# Altium schematic sheet Access_System_F.SchDoc
size A4; SheetNumber: 1; SheetTotal: 1
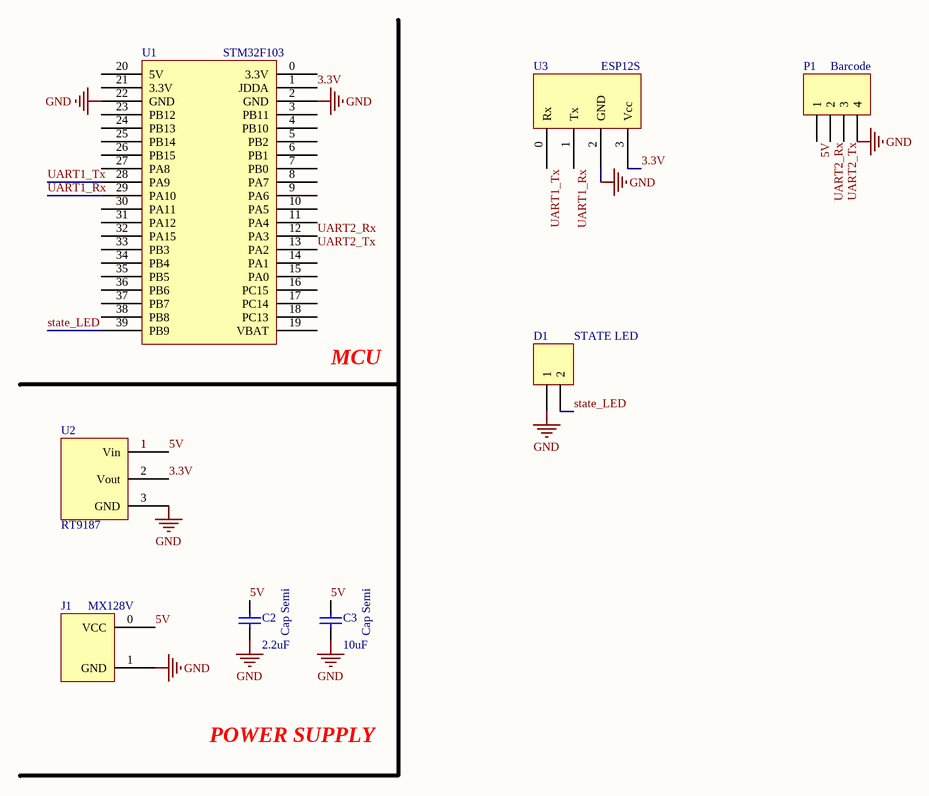
[diagram p0: Access_System_F.SchDoc]

## Parts
C2  Cap Semi  value 2.2uF  [1608[0603]]
C3  Cap Semi  value 10uF  [1608[0603]]
D1  STATE LED  [HDR1X2]
J1  MX128V  [MX128V]
P1  Barcode  [HDR1X4]
U1  STM32F103  [STM32F103]
U2  RT9187  [RT9187]
U3  ESP12S  [ESP12S]

## Nets
GND: C2.1 C3.1 D1.1 J1.1(GND) P1.4 U1.2(GND) U1.22(GND) U2.3(GND) U3.2(GND)
3.3V: U1.1(JDDA) U2.2(Vout) U3.3(Vcc)
5V: C2.2 C3.2 J1.0(VCC) P1.1 U2.1(Vin)
state_LED: D1.2 U1.39(PB9)
UART1_Rx: U1.29(PA10) U3.1(Tx)
UART1_Tx: U1.28(PA9) U3.0(Rx)
UART2_Rx: P1.2 U1.12(PA3)
UART2_Tx: P1.3 U1.13(PA2)

Not connected (* = marked no-connect by the designer): U1 0(3.3V) 3(PB11) 4(PB10) 5(PB2) 6(PB1) 7(PB0) 8(PA7) 9(PA6) 10(PA5) 11(PA4) 14(PA1) 15(PA0) 16(PC15) 17(PC14) 18(PC13) 19(VBAT) 20(5V) 21(3.3V) 23(PB12) 24(PB13) 25(PB14) 26(PB15) 27(PA8) 30(PA11) 31(PA12) 32(PA15) 33(PB3) 34(PB4) 35(PB5) 36(PB6) 37(PB7) 38(PB8)

## Notes on the sheet
- MCU
- POWER SUPPLY

## Library data of the parts
C2 C3 = Cap Semi: Capacitor (Semiconductor SIM Model); Published: 8-Jun-2000; LatestRevisionDate: 29-May-2009; LatestRevisionNote: IPC-7351 Footprint Added.; PackageReference: C1206; Publisher: Altium Limited; PackageDescription: Chip Capacitor
D1 = Header 2: Header, 2-Pin; LatestRevisionDate: 17-Jul-2002; LatestRevisionNote: Re-released for DXP Platform.; Publisher: Altium Limited
P1 = Header 4: Header, 4-Pin; LatestRevisionDate: 17-Jul-2002; LatestRevisionNote: Re-released for DXP Platform.; Publisher: Altium Limited